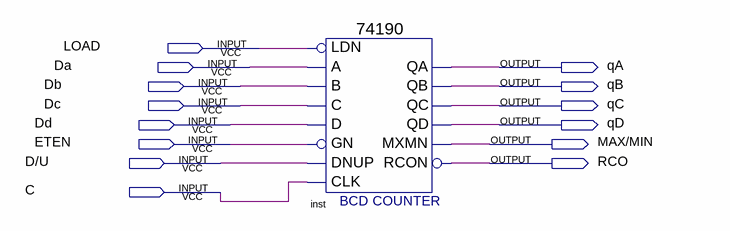
[diagram p0: schematic sheet]
// Quartus schematic kp15533IE12.bdf as structural Verilog: 1 symbols, 14 pins
module kp15533IE12 (
  input  LOAD,
  input  Da,
  input  Db,
  input  Dc,
  input  Dd,
  input  ETEN,
  input  \D/U ,
  input  C,
  output qA,
  output qB,
  output qC,
  output qD,
  output \MAX/MIN ,
  output RCO
);

  \74190  inst (
    .LDN(LOAD), .A(Da), .C(Dc), .B(Db), .D(Dd), .GN(ETEN), .CLK(C), .DNUP(\D/U ), .QA(qA), .QB(qB), .QD(qD),
    .QC(qC), .MXMN(\MAX/MIN ), .RCON(RCO));
endmodule
